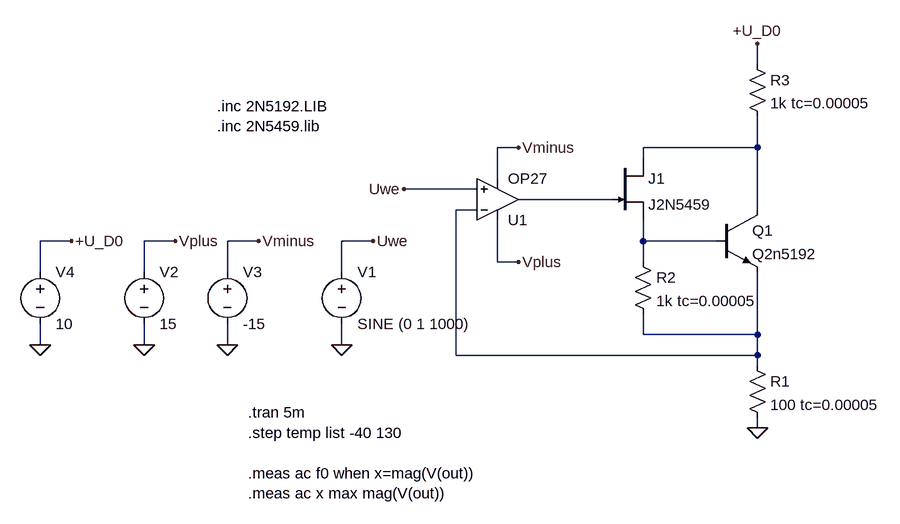
[diagram p0: schematic 34.asc]
34.asc, the LTspice schematic file:
Version 4
SHEET 1 1328 680
WIRE 1120 -128 1120 -160
WIRE 752 0 720 0
WIRE 1120 0 1120 -48
WIRE 1120 0 944 0
WIRE 944 16 944 0
WIRE 720 48 720 0
WIRE 688 64 576 64
WIRE 896 80 752 80
WIRE 688 96 656 96
WIRE 1120 96 1120 0
WIRE 64 144 16 144
WIRE 224 144 176 144
WIRE 352 144 304 144
WIRE 528 144 480 144
WIRE 944 144 944 112
WIRE 1056 144 944 144
WIRE 720 176 720 112
WIRE 752 176 720 176
WIRE 944 176 944 144
WIRE 16 192 16 144
WIRE 176 192 176 144
WIRE 304 192 304 144
WIRE 480 192 480 144
WIRE 944 288 944 256
WIRE 1120 288 1120 192
WIRE 1120 288 944 288
WIRE 16 304 16 272
WIRE 176 304 176 272
WIRE 304 304 304 272
WIRE 480 304 480 272
WIRE 656 320 656 96
WIRE 1120 320 1120 288
WIRE 1120 320 656 320
WIRE 1120 336 1120 320
WIRE 1120 432 1120 416
FLAG 176 304 0
FLAG 304 304 0
FLAG 480 304 0
FLAG 224 144 Vplus
FLAG 352 144 Vminus
FLAG 752 176 Vplus
FLAG 752 0 Vminus
FLAG 1120 432 0
FLAG 528 144 Uwe
FLAG 1120 -160 +U_D0
FLAG 576 64 Uwe
FLAG 16 304 0
FLAG 64 144 +U_D0
SYMBOL voltage 176 176 R0
SYMATTR InstName V2
SYMATTR Value 15
SYMBOL voltage 304 176 R0
SYMATTR InstName V3
SYMATTR Value -15
SYMBOL voltage 480 176 R0
SYMATTR InstName V1
SYMATTR Value SINE (0 1 1000)
SYMBOL OpAmps\\OP27 720 144 M180
SYMATTR InstName U1
SYMBOL res 1104 320 R0
SYMATTR InstName R1
SYMATTR Value 100 tc=0.00005
SYMBOL res 928 160 R0
SYMATTR InstName R2
SYMATTR Value 1k tc=0.00005
SYMBOL res 1104 -144 R0
SYMATTR InstName R3
SYMATTR Value 1k tc=0.00005
SYMBOL voltage 16 176 R0
SYMATTR InstName V4
SYMATTR Value 10
SYMBOL njf 896 16 R0
SYMATTR InstName J1
SYMATTR Value J2N5459
SYMBOL npn 1056 96 R0
SYMATTR InstName Q1
SYMATTR Value Q2n5192
TEXT 288 -64 Left 2 !.inc 2N5192.LIB\n.inc 2N5459.lib
TEXT 336 408 Left 2 !.tran 5m\n.step temp list -40 130\n \n.meas ac f0 when x=mag(V(out))\n.meas ac x max mag(V(out))

The netlist it stands for:
* 34.asc
V2 Vplus 0 15
V3 Vminus 0 -15
V1 Uwe 0 SINE (0 1 1000)
XU1 Uwe N003 Vplus Vminus N002 OP27  ; pins In+ In- V+ V- OUT
R1 N003 0 100 tc=0.00005
R2 N004 N003 1k tc=0.00005
R3 +U_D0 N001 1k tc=0.00005
V4 +U_D0 0 10
J1 N001 N002 N004 J2N5459
Q1 N001 N004 N003 0 Q2n5192
.model NPN NPN
.model PNP PNP
.lib standard.bjt
.model NJF NJF
.model PJF PJF
.lib standard.jft
.inc 2N5192.LIB
.inc 2N5459.lib
.tran 5m
.step temp list -40 130
.meas ac f0 when x=mag(V(out))
.meas ac x max mag(V(out))
.lib ADI.lib
.backanno
.end